# Altium schematic sheet Wi-Fi Radio.SchDoc
size A
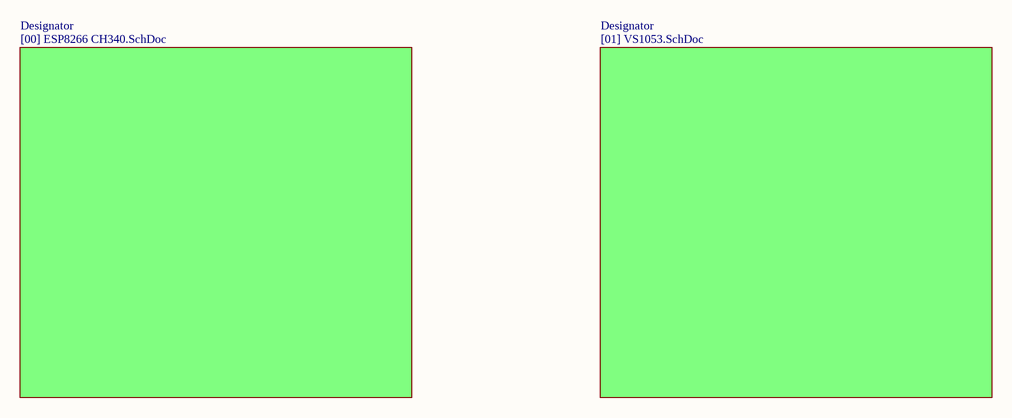
[diagram p0: Wi-Fi Radio.SchDoc]

## Sub-sheets
Designator = [00] ESP8266 CH340.SchDoc: no entries
Designator = [01] VS1053.SchDoc: no entries